# EAGLE design Platypus_v1_0_Proto_v6_0 (EAGLE 7.3.0)
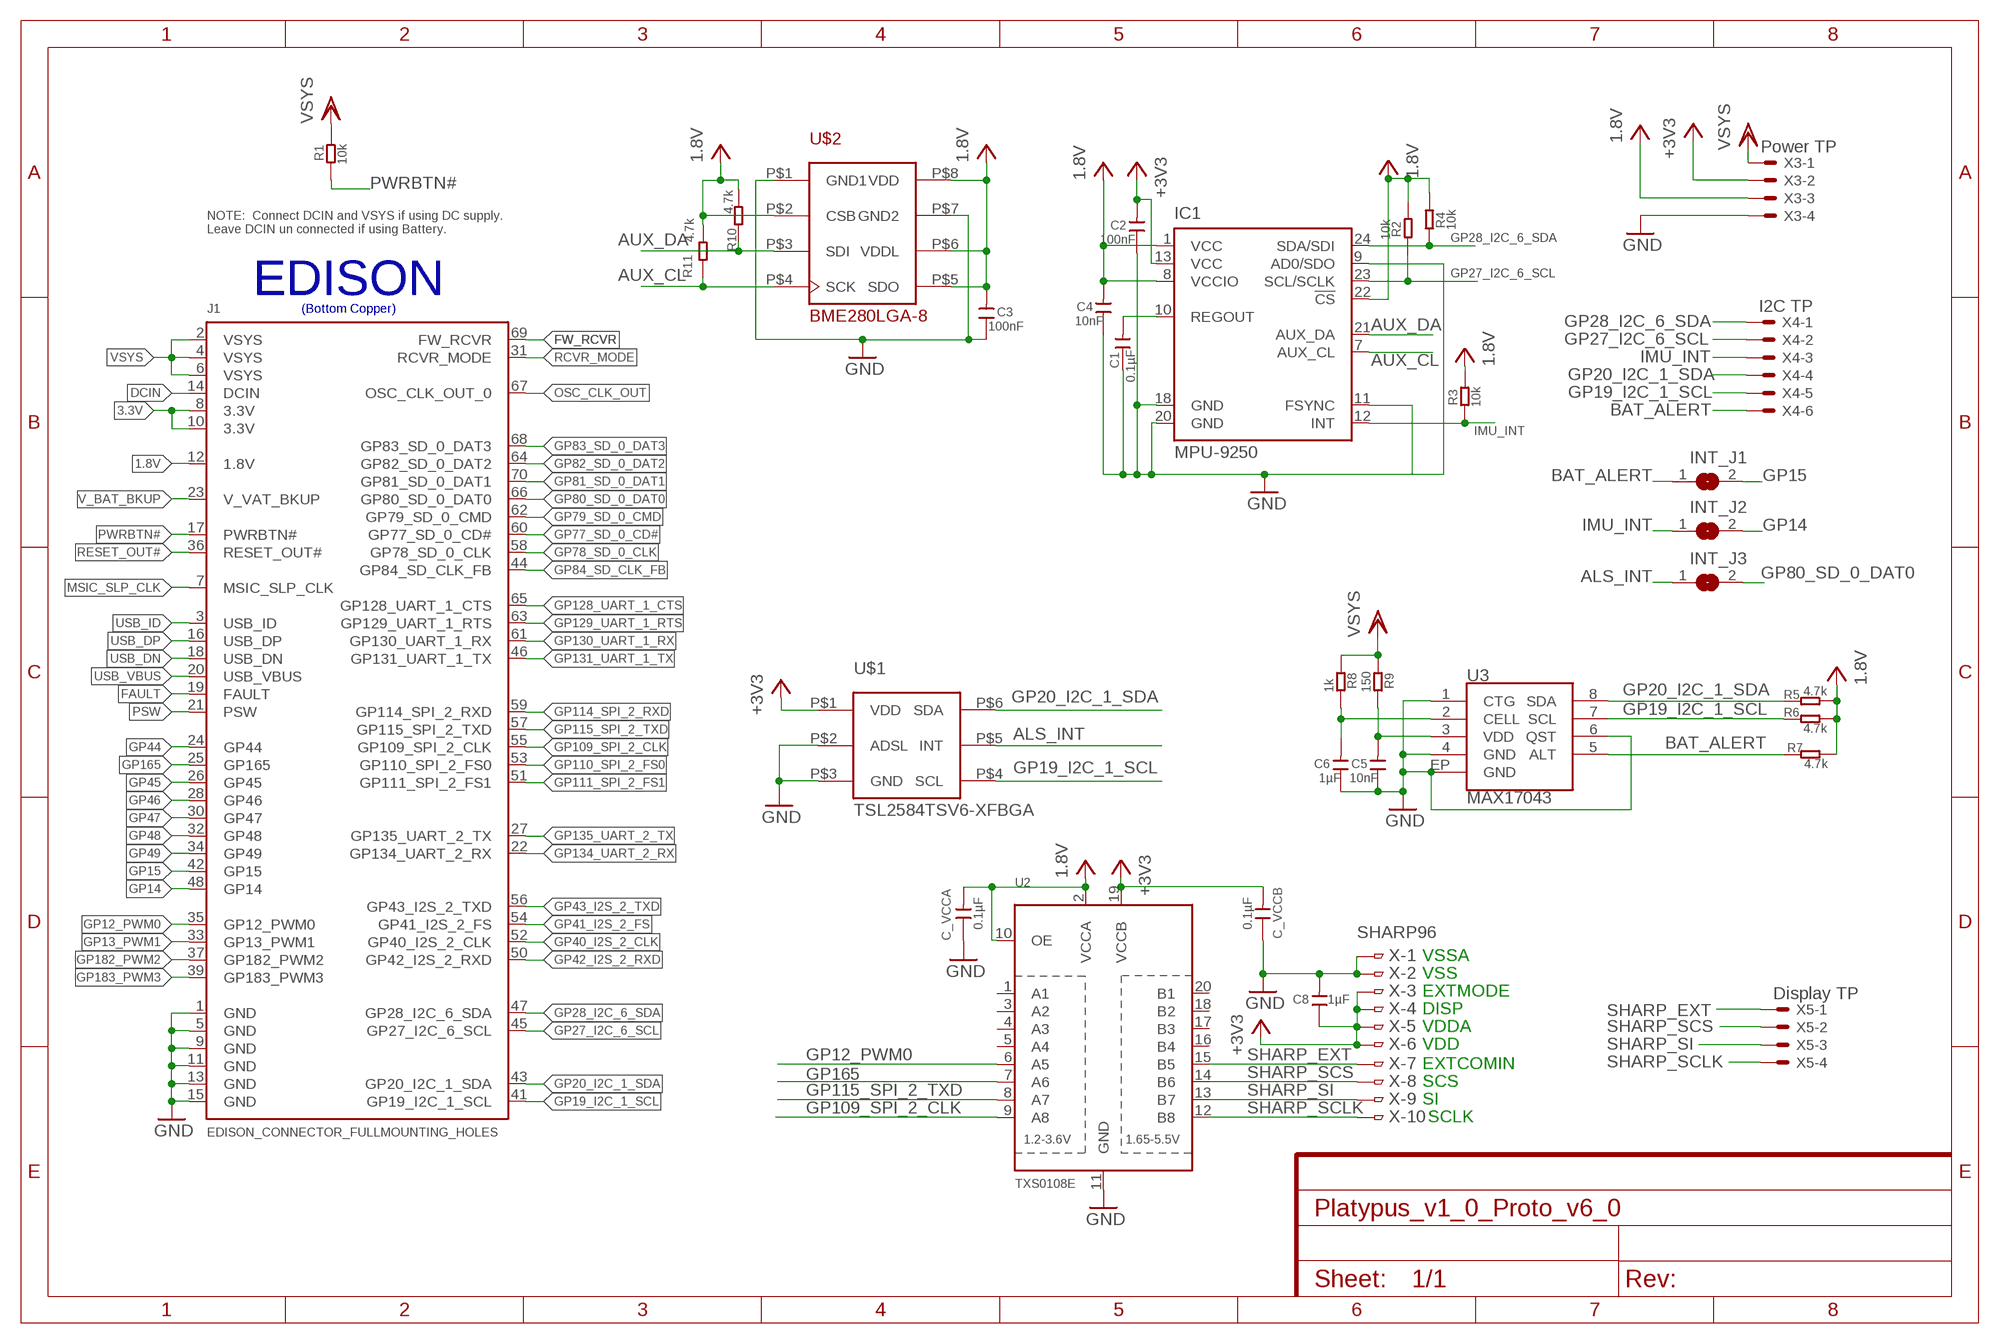
[diagram p0: schematic, sheet 1]

## Parts
C1  0.1µF  C-0603  [C0603]
C2  100nF  C-0603  [C0603]
C3  100nF  C-0603  [C0603]
C4  10nF  C-0603  [C0603]
C5  10nF  C-0603  [C0603]
C6  1µF  C-0603  [C0603]
C8  1µF  C-0603  [C0603]
C_VCCA  0.1µF  C-0603  [C0603]
C_VCCB  0.1µF  C-0603  [C0603]
IC1  MPU-9250  [QFN24-SMALL]
INT_J1  SJ  [SJ]
INT_J2  SJ  [SJ]
INT_J3  SJ  [SJ]
J1  EDISON_CONNECTOR_FULLMOUNTING_HOLES  [EDISON_DAUGHTER]
R1  10k  R-0603  [R0603]
R2  10k  R-0603  [R0603]
R3  10k  R-0603  [R0603]
R4  10k  R-0603  [R0603]
R5  4.7k  R-0603  [R0603]
R6  4.7k  R-0603  [R0603]
R7  4.7k  R-0603  [R0603]
R8  1k  R-0603  [R0603]
R9  150  R-0603  [R0603]
R10  4.7k  R-0603  [R0603]
R11  4.7k  R-0603  [R0603]
U2  TXS0108E  TXB0108PWR  [TSSOP20]
U3  MAX17043  MAX1704X  [TDFN-8]
U$1  TSL2584TSV6-XFBGA  [6-XFBGA]
U$2  BME280LGA-8  [LGA-8]
X  SHARP96  FH12-10S-0.5SH  [FH12-10S-0.5SH]
X3  Power TP  53047-04  [53047-04]
X4  I2C TP  53047-06  [53047-06]
X5  Display TP  53047-04  [53047-04]

## Nets
1.8V: C3.2 C4.2 C_VCCA.2 IC1.1(VCC) IC1.8(VCCIO) IC1.22(!CS) J1.12(1.8V) R2.1 R3.2 R4.2 R5.2 R6.2 R7.1 R10.2 R11.2 U2.2(VCCA) U2.10(OE) U$2.P$2(CSB) U$2.P$5(SDO) U$2.P$6(VDDL) U$2.P$8(VDD) X3.3
3.3V: C2.2 C8.1 C_VCCB.2 IC1.13(VCC) J1.8(3.3V) J1.10(3.3V) U2.19(VCCB) U$1.P$1(VDD) X3.2 X.3 X.4 X.5 X.6 ; supply symbol labelled +3V3
ALS_INT: INT_J3.1 U$1.P$5(INT)
AUX_CL: IC1.7(AUX_CL) R11.1 U$2.P$4(SCK)
AUX_DA: IC1.21(AUX_DA) R10.1 U$2.P$3(SDI)
BAT_ALERT: INT_J1.1 R7.2 U3.5(ALT) X4.6
DCIN: J1.14(DCIN)
FAULT: J1.19(FAULT)
FW_RCVR: J1.69(FW_RCVR)
GND: C1.1 C2.1 C3.1 C4.1 C5.1 C6.1 C8.2 C_VCCA.1 C_VCCB.1 IC1.9(AD0/SDO) IC1.11(FSYNC) IC1.18(GND) IC1.20(GND) J1.1(GND) J1.5(GND) J1.9(GND) J1.11(GND) J1.13(GND) J1.15(GND) U2.11(GND) U3.1(CTG) U3.4(GND) U3.6(QST) U3.EP(GND) U$1.P$2(ADSL) U$1.P$3(GND) U$2.P$1(GND1) U$2.P$7(GND2) X3.4 X.1 X.2
GP12_PWM0: J1.35(GP12_PWM0) U2.6(A5)
GP13_PWM1: J1.33(GP13_PWM1)
GP14: INT_J2.2 J1.48(GP14)
GP15: INT_J1.2 J1.42(GP15)
GP19_I2C_1_SCL: J1.41(GP19_I2C_1_SCL) R6.1 U3.7(SCL) U$1.P$4(SCL) X4.5
GP20_I2C_1_SDA: J1.43(GP20_I2C_1_SDA) R5.1 U3.8(SDA) U$1.P$6(SDA) X4.4
GP27_I2C_6_SCL: IC1.23(SCL/SCLK) J1.45(GP27_I2C_6_SCL) R2.2 X4.2
GP28_I2C_6_SDA: IC1.24(SDA/SDI) J1.47(GP28_I2C_6_SDA) R4.1 X4.1
GP40_I2S_2_CLK: J1.52(GP40_I2S_2_CLK)
GP41_I2S_2_FS: J1.54(GP41_I2S_2_FS)
GP42_I2S_2_RXD: J1.50(GP42_I2S_2_RXD)
GP43_I2S_2_TXD: J1.56(GP43_I2S_2_TXD)
GP44: J1.24(GP44)
GP45: J1.26(GP45)
GP46: J1.28(GP46)
GP47: J1.30(GP47)
GP48: J1.32(GP48)
GP49: J1.34(GP49)
GP77_SD_0_CD#: J1.60(GP77_SD_0_CD#)
GP78_SD_0_CLK: J1.58(GP78_SD_0_CLK)
GP79_SD_0_CMD: J1.62(GP79_SD_0_CMD)
GP80_SD_0_DAT0: INT_J3.2 J1.66(GP80_SD_0_DAT0)
GP81_SD_0_DAT1: J1.70(GP81_SD_0_DAT1)
GP82_SD_0_DAT2: J1.64(GP82_SD_0_DAT2)
GP83_SD_0_DAT3: J1.68(GP83_SD_0_DAT3)
GP84_SD_CLK_FB: J1.44(GP84_SD_CLK_FB)
GP109_SPI_2_CLK: J1.55(GP109_SPI_2_CLK) U2.9(A8)
GP110_SPI_2_FS0: J1.53(GP110_SPI_2_FS0)
GP111_SPI_2_FS1: J1.51(GP111_SPI_2_FS1)
GP114_SPI_2_RXD: J1.59(GP114_SPI_2_RXD)
GP115_SPI_2_TXD: J1.57(GP115_SPI_2_TXD) U2.8(A7)
GP128_UART_1_CTS: J1.65(GP128_UART_1_CTS)
GP129_UART_1_RTS: J1.63(GP129_UART_1_RTS)
GP130_UART_1_RX: J1.61(GP130_UART_1_RX)
GP131_UART_1_TX: J1.46(GP131_UART_1_TX)
GP134_UART_2_RX: J1.22(GP134_UART_2_RX)
GP135_UART_2_TX: J1.27(GP135_UART_2_TX)
GP165: J1.25(GP165) U2.7(A6)
GP182_PWM2: J1.37(GP182_PWM2)
GP183_PWM3: J1.39(GP183_PWM3)
IMU_INT: IC1.12(INT) INT_J2.1 R3.1 X4.3
MSIC_SLP_CLK: J1.7(MSIC_SLP_CLK)
N$5: C1.2 IC1.10(REGOUT)
N$6: C6.2 R8.1 U3.2(CELL)
N$13: C5.2 R9.1 U3.3(VDD)
OSC_CLK_OUT: J1.67(OSC_CLK_OUT_0)
PSW: J1.21(PSW)
PWRBTN#: J1.17(PWRBTN#) R1.1
RCVR_MODE: J1.31(RCVR_MODE)
RESET_OUT#: J1.36(RESET_OUT#)
SHARP_EXT: U2.15(B5) X5.1 X.7
SHARP_SCLK: U2.12(B8) X5.4 X.10
SHARP_SCS: U2.14(B6) X5.2 X.8
SHARP_SI: U2.13(B7) X5.3 X.9
USB_DN: J1.18(USB_DN)
USB_DP: J1.16(USB_DP)
USB_ID: J1.3(USB_ID)
USB_VBUS: J1.20(USB_VBUS)
V_BAT_BKUP: J1.23(V_VAT_BKUP)
VSYS: J1.2(VSYS) J1.4(VSYS) J1.6(VSYS) R1.2 R8.2 R9.2 X3.1
Unconnected: U2.1(A1) U2.3(A2) U2.4(A3) U2.5(A4) U2.16(B4) U2.17(B3) U2.18(B2) U2.20(B1)

## Notes on the sheet
- NOTE:  Connect DCIN and VSYS if using DC supply.
  Leave DCIN un connected if using Battery.
- EDISON
- (Bottom Copper)
- VSSA
- VSS
- EXTMODE
- DISP
- VDDA
- VDD
- EXTCOMIN
- SCS
- SI
- SCLK

## Library data of the parts
C1-C6 C8 C_VCCA C_VCCB = Discrete:C*: Ceramic Capacitors
IC1 = invensense:MPU-9250: 9-axis MotionTracking device communicate with I2C/SPI Source: http://www.invensense.com/mems/gyro/documents/PS-MPU-9250A-01.pdf
INT_J1-INT_J3 = jumper:SJ: SMD solder JUMPER
J1 = Edison:EDISON_CONNECTOR_FULL
R1-R11 = Discrete:R*
U2 = adafruit:TXB0108PWR: 8-Bit Bi-Directional Level Shifter 1.2V-3.6V (VCCA) to 1.65V-5.5V (VCCB) bi-directional level shifter with auto direction sensing. Max data rate - VCCA 1.8V: 20Mbps (50ns), VCCA 3.3V: 100Mbps (10ns) Digikey: 296-21527-1-ND
U3 = SparkFun-PowerIC:MAX1704X: MAX17043/MAX17044: Battery Fuel Guage (43 is 1cell, 44 is 2cell); PROD-ID: IC-10399
U$1 = TSL2584TSV:TSL2584TSV
U$2 = BME280:BME280
X = con-hirose:FH12-10S-0.5S: 0.5mm Pitch Connectors For FPC/FFC Source: Data sheet <http://www.hirose.co.jp/cataloge_hp/e58605370.pdf>; MPN: FH12-10S-0.5SH(55); OC_FARNELL: 1324540; OC_NEWARK: 34M6152
X3 X5 = con-molex:53?-04: CONNECTOR wire to board 1.25 mm (.049 inch) pitch header; MF: WALDOM/MOLEX; MPN: 53047-0410; OC_FARNELL: 9733060; OC_NEWARK: 38C9900
X4 = con-molex:53?-06: CONNECTOR wire to board 1.25 mm (.049 inch) pitch header; MPN: 53047-0610-C; OC_FARNELL: 9733078; OC_NEWARK: 03M2965

## Board
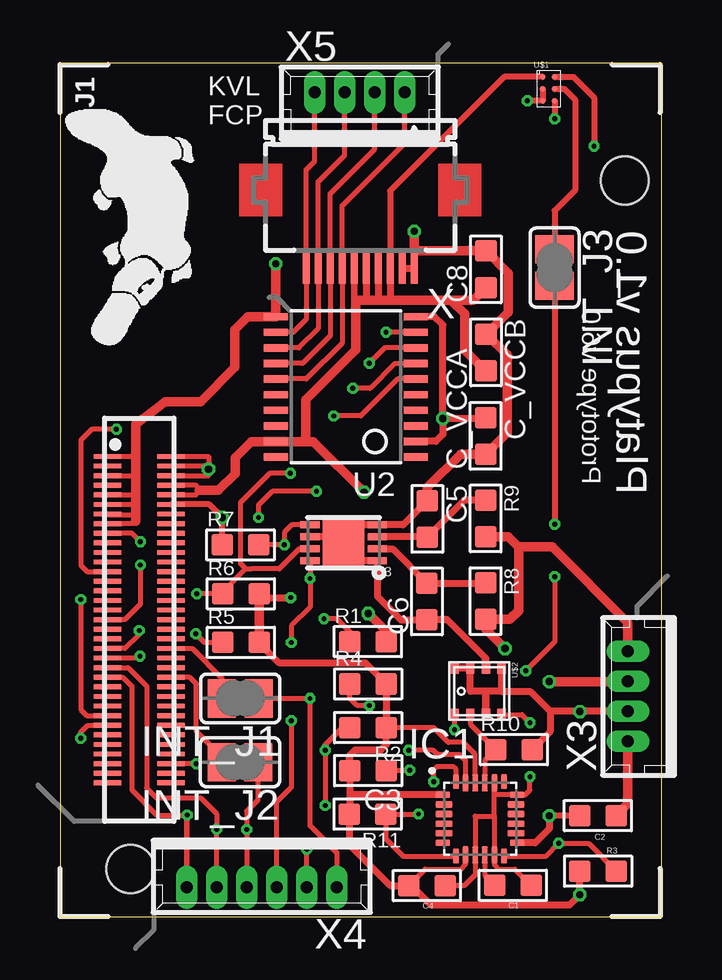
[diagram p1: board, top side]
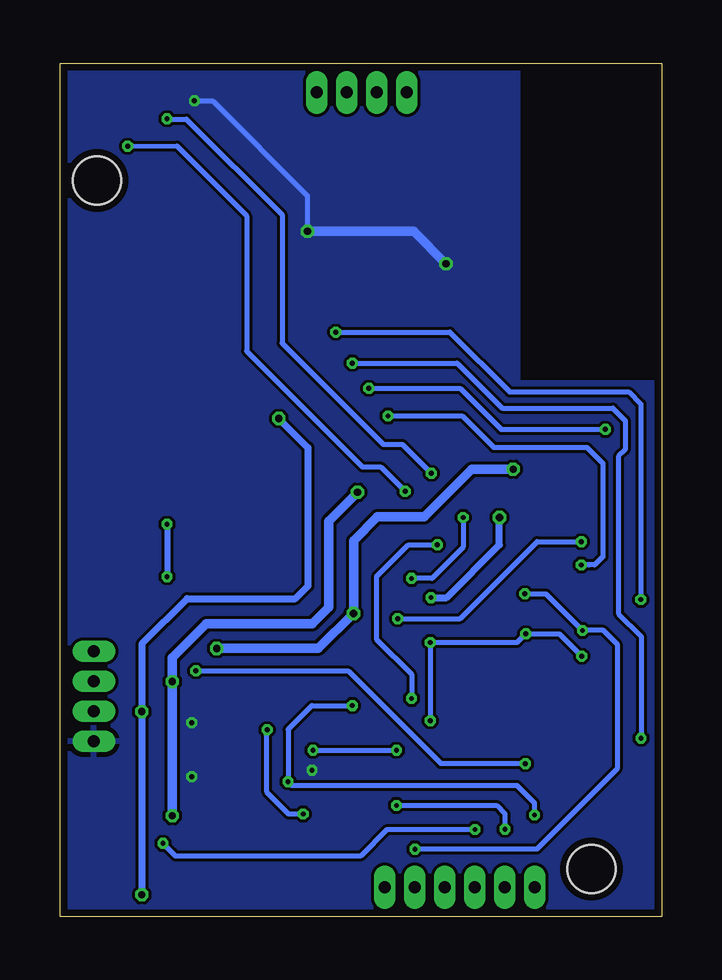
[diagram p2: board, bottom side, seen from below]

Size 25.07 x 35.55 mm. Coordinates in mm from the lower left corner, seen from the top.
Outline: 0,0 25.07,0 25.07,35.55 0,35.55 0,0
Copper layers (1*16): Top 0.035mm / dielectric 1.5mm / Bottom 0.035mm
Design rules "PCB-POOL HighSpec": minimum track width 0.125mm, minimum drill 0.2mm, track to track 0.125mm, track to pad 0.125mm, pad to pad 0.125mm, via to via 0.125mm, smd to smd 0.125mm, copper to edge 0.3mm, drill to drill 0.2mm, minimum pad ring 0.2mm, minimum via ring 0.125mm, stop-mask expansion 0.075mm, vias tented up to drill 0mil, thermal gap 0.2mm

### Footprints (pad centres in the part's own frame; a part is rotated, then mirrored left to right if it is on the bottom)
C0603 = smd 0.889 x 0.889: 1 -0.762,0; 2 0.762,0
QFN24-SMALL = smd 0.6 x 0.25: 1 -1.55,1; 6 -1.55,-1; 13 1.55,-1; 18 1.55,1 | smd 0.7 x 0.25: 2 -1.5,0.6; 3 -1.5,0.2; 4 -1.5,-0.2; 5 -1.5,-0.6; 14 1.5,-0.6; 15 1.5,-0.2; 16 1.5,0.2; 17 1.5,0.6 | smd 0.25 x 0.6: 7 -1,-1.55; 12 1,-1.55; 19 1,1.55; 24 -1,1.55 | smd 0.25 x 0.7: 8 -0.6,-1.5; 9 -0.2,-1.5; 10 0.2,-1.5; 11 0.6,-1.5; 20 0.6,1.5; 21 0.2,1.5; 22 -0.2,1.5; 23 -0.6,1.5
SJ = smd 1.168 x 1.6: 1 -0.762,0; 2 0.762,0
EDISON_DAUGHTER = smd 1.14 x 0.2: 1 1.98,19.17; 2 4.62,19.17; 3 1.98,18.77; 4 4.62,18.77; 5 1.98,18.37; 6 4.62,18.37; 7 1.98,17.97; 8 4.62,17.97; 9 1.98,17.57; 10 4.62,17.57; 11 1.98,17.17; 12 4.62,17.17; 13 1.98,16.77; 14 4.62,16.77; 15 1.98,16.37; 16 4.62,16.37; 17 1.98,15.97; 18 4.62,15.97; 19 1.98,15.57; 20 4.62,15.57; 21 1.98,15.17; 22 4.62,15.17; 23 1.98,14.77; 24 4.62,14.77; 25 1.98,14.37; 26 4.62,14.37; 27 1.98,13.97; 28 4.62,13.97; 29 1.98,13.57; 30 4.62,13.57; 31 1.98,13.17; 32 4.62,13.17; 33 1.98,12.77; 34 4.62,12.77; 35 1.98,12.37; 36 4.62,12.37; 37 1.98,11.97; 38 4.62,11.97; 39 1.98,11.57; 40 4.62,11.57; 41 1.98,11.17; 42 4.62,11.17; 43 1.98,10.77; 44 4.62,10.77; 45 1.98,10.37; 46 4.62,10.37; 47 1.98,9.97; 48 4.62,9.97; 49 1.98,9.57; 50 4.62,9.57; 51 1.98,9.17; 52 4.62,9.17; 53 1.98,8.77; 54 4.62,8.77; 55 1.98,8.37; 56 4.62,8.37; 57 1.98,7.97; 58 4.62,7.97; 59 1.98,7.57; 60 4.62,7.57; 61 1.98,7.17; 62 4.62,7.17; 63 1.98,6.77; 64 4.62,6.77; 65 1.98,6.37; 66 4.62,6.37; 67 1.98,5.97; 68 4.62,5.97; 69 1.98,5.57; 70 4.62,5.57 | hole 2: 23.53,30.67; 2.93,1.98
R0603 = smd 0.889 x 0.889: 1 -0.762,0; 2 0.762,0
TSSOP20 = smd 0.305 x 0.991: 1 -2.925,-2.918; 2 -2.275,-2.918; 3 -1.625,-2.918; 4 -0.975,-2.918; 5 -0.325,-2.918; 6 0.325,-2.918; 7 0.975,-2.918; 8 1.625,-2.918; 9 2.275,-2.918; 10 2.925,-2.918; 11 2.925,2.918; 12 2.275,2.918; 13 1.625,2.918; 14 0.975,2.918; 15 0.325,2.918; 16 -0.325,2.918; 17 -0.975,2.918; 18 -1.625,2.918; 19 -2.275,2.918; 20 -2.925,2.918
TDFN-8 = smd 0.8 x 0.3: 1 -1.4,0.75; 2 -1.4,0.25; 3 -1.4,-0.25; 4 -1.4,-0.75; 5 1.4,-0.75; 6 1.4,-0.25; 7 1.4,0.25; 8 1.4,0.75 | smd 1.73 x 1.88: EP 0,0
6-XFBGA = smd 0.226 x 0.226: P$1 -0.25,0.5; P$2 -0.25,0; P$3 -0.25,-0.5; P$4 0.25,-0.5; P$5 0.25,0; P$6 0.25,0.5
LGA-8 = smd 0.5 x 0.35: P$1 0.975,0.975; P$2 0.975,0.325; P$3 0.975,-0.325; P$4 0.975,-0.975; P$5 -0.975,-0.975; P$6 -0.975,-0.325; P$7 -0.975,0.325; P$8 -0.975,0.975
FH12-10S-0.5SH = smd 0.3 x 1.3: 1 -2.25,3.25; 2 -1.75,3.25; 3 -1.25,3.25; 4 -0.75,3.25; 5 -0.25,3.25; 6 0.25,3.25; 7 0.75,3.25; 8 1.25,3.25; 9 1.75,3.25; 10 2.25,3.25
53047-04 = drill 0.5 pad 0.698 long: 1 1.875,0.45; 2 0.625,0.45; 3 -0.625,0.45; 4 -1.875,0.45
53047-06 = drill 0.5 pad 0.698 long: 1 3.125,0.45; 2 1.875,0.45; 3 0.625,0.45; 4 -0.625,0.45; 5 -1.875,0.45; 6 -3.125,0.45

### Placement (x,y rotation side)
C1  18.87,1.3 180 top
C2  22.41,4.21 180 top
C3  12.84,6.08 180 top
C4  15.29,1.29 180 top
C5  15.31,16.57 270 top
C6  15.29,13.13 90 top
C8  17.75,26.97 90 top
C_VCCA  17.73,20.03 90 top
C_VCCB  17.75,23.51 270 top
IC1  17.5,4.07 0 top
INT_J1  7.51,9.09 180 top
INT_J2  7.5,6.43 180 top
INT_J3  20.61,27.04 270 top
J1  0,0 0 top
R1  12.83,11.46 0 top
R2  12.84,7.87 180 top
R3  22.42,1.89 180 top
R4  12.84,9.69 0 top
R5  7.54,11.42 0 top
R6  7.54,13.45 0 top
R7  7.52,15.49 0 top
R8  17.73,13.14 270 top
R9  17.73,16.59 270 top
R10  18.91,6.96 0 top
R11  12.82,4.27 180 top
U2  11.91,22.07 90 top
U3  11.82,15.57 180 top
U$1  20.36,34.49 0 top
U$2  17.42,9.39 270 top
X  12.51,30.27 180 top
X3  24.11,9.17 90 top
X4  8.41,1.67 180 top
X5  12.49,33.89 0 top

### Tracks (layer width: path | path; a pad name or v marks a point on that pad's centre or on a via)
1.8V  (via drill 0.2, 0.3)
  Top 0.2: C_VCCA.2 17.69,20.75 | C4.2 15.22,1.98 16.71,1.98 16.9,2.17 IC1.8 | 12.08,4.29 R11.2 | 13.61,7.88 R2.1 13.61,7.86 15.58,7.86 16.18,7.26 16.8,7.26 17.3,6.76 IC1.22
  Top 0.24: 6.22,17.17 J1.12
  Top 0.25: R7.1 v6.76,16.63 | v6.76,16.63 6.22,17.17
  Top 0.3: v15.95,20.75 v15.95,20.74 v15.96,20.75 17.69,20.75 | v15.95,20.75 15.95,24.65 15.6,25 U2.10 | v15.95,20.75 15.95,20.09 15.66,19.8 U2.2 | R3.2 v21.66,0.91 v21.65,0.91 21.23,0.49 15.44,0.49 14.59,1.34 C4.2 13.77,1.29 12.06,3 R11.2 | v6.76,16.63 | R6.2 8.31,13.29 | X3.3 v21.67,8.55 | v21.67,8.55 v21.66,8.54 | 8.3,11.39 8.29,11.39 8.29,13.29 8.31,13.29 | 8.3,11.37 R5.2 | 18.41,10.37 U$2.P$8 18.39,9.38 | U$2.P$5 U$2.P$6 17.1,9.38 17.74,9.38 | 8.3,11.41 R5.2 | R5.2 8.3,11.4 9.14,10.56 12.73,10.56 R4.2 R2.1 13.6,7.17 13.37,6.94 12.3,6.94 12.08,6.72 C3.2 12.08,5.07 | 8.31,13.29 v9.61,13.29 | 12.08,5.07 12.08,4.29 | v21.67,8.55 20.42,8.55 | R10.2 20.42,7.71 20.42,8.55 | IC1.1 12.08,5.07 | 17.75,9.38 17.74,9.38 | 18.39,9.38 17.75,9.38 | 17.75,9.38 U$2.P$2 17.74,9.38 | 18.39,9.38 19.58,9.38 20.42,8.55
  Top 0.4: R6.2 R5.2 | R7.1
  Bottom 0.3: v21.66,0.91 21.66,4.89 v21.66,8.54 21.66,11.36 19.77,13.25 15.26,13.25 14.74,13.77 14.74,19.54 v15.95,20.75 | v9.61,13.29 8.96,13.29 R7.1 v6.76,16.63
3.3V  (via drill 0.3)
  Top 0.2: J1.8 5.68,17.97 5.8,17.76 5.66,17.57 J1.10 | C_VCCB.2 17.71,22.75
  Top 0.25: C2.2 21.64,4.2 v20.39,4.2
  Top 0.254: U$1.P$1 18.51,34.99 13.76,30.24 X.3
  Top 0.28: X.6 12.26,25.68 12.32,25.68
  Top 0.3: 13.76,27.05 X.3 13.76,25.68 13.74,25.68 | U2.19 | X3.2 | X.6 | X.5 12.76,25.68 | X.4 13.26,25.68 13.27,25.68 | v20.39,4.2 20.39,3.66 19.8,3.07 IC1.13
  Top 0.4: 10.23,19.79 U2.19 7.97,19.79 7.3,19.12 7.3,18.46 6.6,17.76 5.8,17.76 | 10.23,19.79 10.23,21.53 12.32,23.62 12.32,25.68 12.76,25.68 13.27,25.68 13.74,25.68 | 13.76,25.68 16.29,25.68 | 16.29,25.68 17.22,25.68 C8.1 | 17.71,22.75 16.86,23.6 16.86,25.11 16.29,25.68 | X3.2 v20.39,9.79 | 10.23,19.79 10.56,19.79 v12.67,17.68
  Bottom 0.4: v20.39,4.2 v20.39,9.79 20.39,10.78 18.97,12.2 14.55,12.2 13.87,12.88 13.87,16.48 v12.67,17.68
ALS_INT
  Top 0.254: U$1.P$5 21.01,34.49 21.46,34.04 21.46,30.26 20.61,29.41 INT_J3.1
AUX_CL  (via drill 0.2)
  Top 0.2: IC1.7 14.31,2.51 13.58,3.24 R11.1 v14.94,4.27 | v16.44,7.78 U$2.P$4
  Bottom 0.2: v16.44,7.78 16.45,7.81 16.45,5.18 15.54,4.27 v14.94,4.27
AUX_DA
  Top 0.2: U$2.P$3 17.09,8.01 R10.1 17.7,6.51 IC1.21
BAT_ALERT  (via drill 0.2)
  Top 0.2: X4.6 11.53,2.67 10.42,3.78 v10.42,9.09 INT_J1.1 8.28,9.08 | R7.2 v9.35,15.49 9.35,16.01 9.66,16.32 U3.5
  Top 0.3: INT_J1.1 8.29,9.07
  Bottom 0.2: v9.35,15.49 10.55,15.49 11.89,14.15 11.89,11.56 10.42,10.09 v10.42,9.09
GND  (via drill 0.2, 0.3)
  Top 0.2: 3.15,16.47 3.04,16.37 J1.15 | J1.13 2,16.75 3.15,16.75 | J1.11 3.1,17.17 arc90 3.15,17.22 | J1.1 3.13,19.17 arc-90 3.15,19.15 | J1.5 3.08,18.37 arc-90 3.15,18.3 | J1.9 3.13,17.57 arc90 3.15,17.59 | C_VCCB.1 17.77,24.27 | X.1 14.76,27.73 | C4.1 16.85,1.29 17.3,1.74 IC1.9 17.3,4.18 18.1,4.18 | C1.1 18.95,1.98 18.27,1.98 18.1,2.15 IC1.11 18.1,4.18 | 18.1,4.18 18.1,5.06 | 18.1,5.06 IC1.20 | 13.62,6.1 C3.1 13.6,6.03 13.67,6.1 v14.57,6.1 | 18.1,5.06 18.11,5.07 IC1.18 19.38,5.07 19.58,5.27 v19.58,5.83 | U$2.P$1 19.25,8.41 v19.58,8.08
  Top 0.254: U$1.P$2 U$1.P$3 v19.47,33.99
  Top 0.3: 12.57,16.32 U3.4 14.3,16.32 C5.1 | 12.26,14.82 U3.1 13.22,13.34 14.2,12.36 C6.1 | 11.57,15.82 U3.6 | X.2 X.1 | U$2.P$7 17.75,10.75 16.13,12.37 C6.1
  Top 0.4: X3.4 23.66,4.7 C2.1 | v8.99,27.2 U2.11 7.83,24.99 7.29,24.45 7.29,22.88 5.86,21.45 4.39,21.45 3.15,20.51 3.15,19.15 3.15,18.3 3.15,17.59 3.15,17.22 3.15,16.75 3.15,16.47 | C_VCCB.1 18.67,25.19 18.67,26.81 C8.2 14.76,27.73 v14.76,28.55 | 17.77,24.27 18.63,23.41 18.63,20.17 C_VCCA.1 16.7,19.27 15.31,17.88 C5.1
  Top 0.406: 12.57,16.32 arc90 U3.EP | 12.26,14.82 arc-90 12.21,14.87 12.21,15.18 arc90 U3.EP | U3.EP 11.57,15.82 | C6.1
  Bottom 0.2: v19.47,33.99 18.71,33.99 14.76,30.04 v14.76,28.55
  Bottom 0.4: v14.76,28.55 10.34,28.55 v8.99,27.2
  pour Bottom: 5.99,35.44 24.97,35.44 24.97,0.14 0.1,0.14 0.1,22.25 5.97,22.25 5.97,35.43
GP12_PWM0  (via drill 0.2)
  Top 0.2: U2.6 14.08,22.4 12.54,20.86 v11.4,20.86 | v3.35,14.65 3.35,13.02 2.7,12.37 J1.35
  Bottom 0.2: 3.02,14.65 v3.35,14.65 2.79,14.65 2.45,14.99 2.45,18.88 3.12,19.55 7,19.55 8.31,20.86 v11.4,20.86
GP14
  Top 0.2: 6.74,6.66 5.68,7.72 5.68,9.69 5.4,9.97 J1.48
  Top 0.3: INT_J2.2 6.74,6.66
GP15
  Top 0.2: INT_J1.2 6.75,9.93 5.51,11.17 J1.42
  Top 0.3: INT_J1.2 6.72,9.12
GP19_I2C_1_SCL  (via drill 0.2)
  Top 0.2: J1.41 2.7,11.17 3.3,11.77 v3.3,11.92 | X4.5 v10.28,2.81 | v9.6,18.47 8.74,18.47 7.52,17.25 7.52,14.72 7.75,14.49 | U3.7 9.97,15.32 9.14,14.49 7.96,14.49 7.75,14.49 | v5.7,13.45 R6.1 6.78,13.52 7.75,14.49
  Top 0.254: U$1.P$4 v20.61,33.24
  Bottom 0.2: 2.44,11.92 1.86,11.35 | 1.86,11.35 2.43,11.92 v3.3,11.92 4.83,13.45 v5.7,13.45 | 1.86,11.35 1.86,6.15 5.2,2.81 v10.28,2.81 | v20.61,33.24 v20.62,33.23 19.8,33.23 15.82,29.25 15.82,23.89 11.6,19.67 10.8,19.67 v9.6,18.47
GP20_I2C_1_SDA  (via drill 0.2)
  Top 0.2: v3.33,10.85 3.25,10.77 J1.43 | X4.4 9.03,4.79 9.64,5.39 v9.64,8.16 | v5.66,11.78 6.02,11.42 R5.1 | U3.8 v10.42,14.09 10.42,12.89 9.64,12.11 v9.64,11.42 | v10.69,17.72 8.85,17.72 8.27,17.14 v8.27,16.63
  Top 0.254: U$1.P$6 21.38,34.99 22.25,34.12 v22.25,32.1
  Bottom 0.2: v5.66,11.78 4.26,11.78 v3.33,10.85 | v5.67,11.77 v5.66,11.78 | v5.66,11.78 6.02,11.42 v9.64,11.42 v9.64,8.16 | v22.25,32.1 20.2,32.11 17.29,29.2 17.29,23.56 12.47,18.74 11.71,18.74 v10.69,17.72 | v8.27,16.63 8.27,15.39 9.57,14.09 v10.42,14.09
GP27_I2C_6_SCL  (via drill 0.2)
  Top 0.2: J1.45 2.84,10.37 3.61,9.6 3.61,5.35 4.01,4.95 5.86,4.95 6.53,4.28 v6.53,3.64 v6.53,3.63 X4.2 | 11.06,6.85 v11.05,6.93 | R2.2 11.77,7.87 11.05,7.15 v11.05,6.93 | IC1.23 16.9,6.5 16.65,6.75 15.73,6.75 15.56,6.92 v14.54,6.92 v14.53,6.93 | v11.05,6.93 v11.05,4.63
  Bottom 0.2: v14.53,6.93 v11.05,6.93 | v11.05,4.63 6.88,4.63 6.53,4.28 v6.53,3.64
GP28_I2C_6_SDA  (via drill 0.2)
  Top 0.2: 5.28,4.21 X4.1 5.29,1.12 5.29,4.21 5.27,4.23 | v5.29,4.24 v5.3,4.23 4.04,4.23 2.99,5.28 2.99,9.6 2.62,9.97 J1.47 | v12.89,8.79 12.39,8.79 12.08,9.1 R4.1 | IC1.24 16.5,6.13 16.38,6.25 15.71,6.25 15.57,6.11 v15.57,5.62
  Top 0.3: v5.3,4.23 5.28,4.21
  Bottom 0.2: v5.3,4.23 5.3,4.74 6.03,5.47 15.42,5.47 v15.57,5.62 15.57,7.8 14.58,8.79 v12.89,8.79
GP80_SD_0_DAT0  (via drill 0.2)
  Top 0.2: v5.68,6.37 J1.66 | v20.61,14.16 20.61,11.44 v19.41,10.24
  Top 0.254: INT_J3.2 v20.61,16.35
  Bottom 0.2: v19.41,10.24 13.07,10.24 9.21,6.38 v5.69,6.38 v5.68,6.37
  Bottom 0.254: v20.61,16.35 v20.61,14.16
GP109_SPI_2_CLK  (via drill 0.2)
  Top 0.2: v0.87,13.21 0.87,8.62 1.12,8.37 J1.55 | U2.9 v13.58,24.35
  Bottom 0.2: 0.87,13.15 v0.87,13.21 0.87,21.35 1.38,21.86 6.34,21.86 8.83,24.35 v13.58,24.35
GP115_SPI_2_TXD  (via drill 0.2)
  Top 0.2: v0.86,7.43 0.86,7.67 1.16,7.97 J1.57 | U2.8 13.53,23.7 v12.89,23.06
  Bottom 0.2: v0.86,7.43 0.86,11.68 1.8,12.62 1.8,19.17 1.52,19.45 1.52,20.69 1.53,20.69 2.03,21.19 6.65,21.19 8.52,23.06 v12.89,23.06
GP165  (via drill 0.2)
  Top 0.2: U2.7 13.95,23.05 12.92,22.01 v12.2,22.01 | v2.35,20.3 1.32,20.3 0.87,19.85 0.87,14.63 1.13,14.37 J1.25
  Bottom 0.2: v2.34,20.29 v2.35,20.3 6.69,20.3 8.4,22.01 v12.2,22.01
IMU_INT  (via drill 0.2)
  Top 0.2: R3.1 22.02,3.05 v20.78,3.05 20.25,2.52 IC1.12 | X4.3 7.78,3.26 v7.78,3.63 7.78,4.39 8.24,4.85 8.24,6.41
  Top 0.3: 8.25,6.42 INT_J2.1 8.24,6.41
  Bottom 0.2: v7.78,3.63 11.43,3.63 12.54,2.52 20.25,2.52 20.39,2.66 v20.78,3.05
N$5
  Top 0.2: IC1.10 17.7,1.71 C1.2
N$6
  Top 0.3: 17.68,13.89 C6.2 13.86,15.32 U3.2
  Top 0.406: 17.68,13.89 R8.1
N$13
  Top 0.3: 15.3,15.82 U3.3 | R9.1 16.85,17.35 C5.2
  Top 0.406: C5.2 15.3,15.82
PWRBTN#  (via drill 0.2)
  Top 0.2: v3.35,15.62 3,15.97 J1.17 | R1.1 12.17,11.24 12.17,11.76 11.53,12.4 v11.01,12.4 v11,12.41
  Bottom 0.2: v3.35,15.62 5.19,15.62 8.4,12.41 v11,12.41
SHARP_EXT
  Top 0.2: U2.15 10.27,22.4 11.76,23.89 X.7 11.76,29.62 14.37,32.23 X5.1
SHARP_SCLK
  Top 0.2: X5.4 10.61,34.4 10.61,31.47 10.26,31.12 X.10 10.26,24.88 10.25,24.88 9.71,24.34 U2.12
SHARP_SCS
  Top 0.2: U2.14 10.11,23.05 11.26,24.2 X.8 11.26,30.12 13.11,31.97 X5.2
SHARP_SI
  Top 0.2: U2.13 9.95,23.7 10.75,24.5 10.76,24.5 X.9 10.76,30.62 11.86,31.72 X5.3
VSYS  (via drill 0.3)
  Top 0.2: v6.19,18.64 6.06,18.77 J1.4 | J1.2 6.19,19.17 v6.19,18.64 | J1.6 6.19,18.37 v6.19,18.64
  Top 0.3: 18.74,12.38 18.73,12.38
  Top 0.4: R9.2 18.67,15.83 19.11,15.39 | 19.11,15.39 19.11,12.75 18.73,12.38 R8.2 | X3.1 23.66,12.25 20.51,15.4 19.12,15.4 19.11,15.39 | R8.2 17.73,11.98 v18.54,11.17 | R1.2 13.59,11.88 v12.84,12.63
  Top 0.406: R8.2
  Bottom 0.4: v6.19,18.64 7.91,18.64 9.9,16.65 11.85,16.65 12.84,15.66 v12.84,12.63 14.3,11.17 v18.54,11.17

### Text on the board
tDocu: Display Test Point | SHARP_SCK | SHARP_SI | SHARP_SCS | SHARP_EXT | TSL2584TSV | Ambient / Light / Sensor | SHARP / Display / Connector | Antenna KOZ | J_ALS | TXS0108E | C8 1µF | C_VCCB / / 0.1µF | Level / / Shifter | C_VCCA / / 0.1µF | R7 4k7 | MAX / 17043 | C5 10nF | R9 150 | R6 4k7 | Battery / Gauge | Power / Test / Point | C6 1µF | R5 4k7 | R1 10k | R8 1k | J_BAT | VSYS | R4 10k | 3V3 | Pressure / Humidity / Temperature / Sensor | BME / 280 | 1V8 | J_IMU | R2 10k | R10 4k7 | GND | Intel Edison 70-pin Hirose Connector | C3 100nF | R11 4k7 | MPU / 9255 | C2 100nF | 9DOF / IMU | C4 10nF | C1 0.1µF | R3 10k | IMU_SDA | IMU_SCL | IMU_INT | BAT_SDA | BAT_SCL | BAT_INT | I2C Test Point
tSilk: KVL / FCP | Platypus v1.0
_tsilk: Prototype v6.0